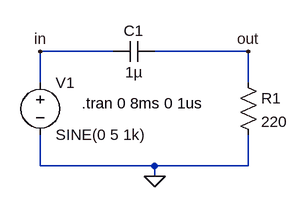
[diagram p0: schematic Draft2.asc]
Draft2.asc, the LTspice schematic file:
Version 4
SHEET 1 880 680
WIRE 128 80 16 80
WIRE 336 80 192 80
WIRE 16 128 16 80
WIRE 336 128 336 80
WIRE 16 256 16 208
WIRE 192 256 16 256
WIRE 336 256 336 208
WIRE 336 256 192 256
WIRE 192 272 192 256
FLAG 192 272 0
FLAG 16 80 in
FLAG 336 80 out
SYMBOL voltage 16 112 R0
WINDOW 123 0 0 Left 0
WINDOW 39 0 0 Left 0
SYMATTR InstName V1
SYMATTR Value SINE(0 5 1k)
SYMBOL cap 192 64 R90
WINDOW 0 0 32 VBottom 2
WINDOW 3 32 32 VTop 2
SYMATTR InstName C1
SYMATTR Value 1µ
SYMBOL res 320 112 R0
SYMATTR InstName R1
SYMATTR Value 220
TEXT 80 160 Left 2 !.tran 0 8ms 0 1us

The netlist it stands for:
* Draft2.asc
V1 in 0 SINE(0 5 1k)
C1 out in 1µ
R1 out 0 220
.tran 0 8ms 0 1us
.backanno
.end